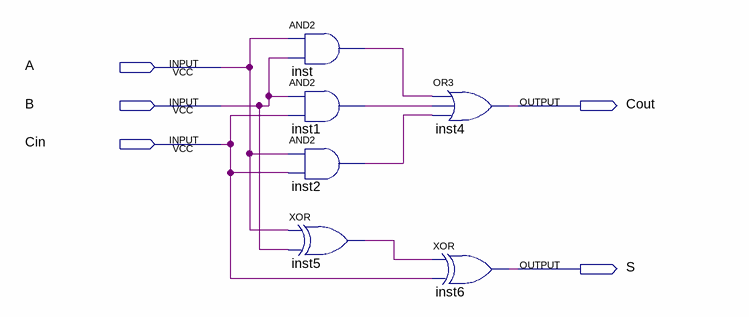
[diagram p0: schematic sheet]
// Quartus schematic TP1.bdf as structural Verilog: 6 symbols, 5 pins
module TP1 (
  input  A,
  input  B,
  input  Cin,
  output Cout,
  output S
);

  wire inst1_out, inst2_out, inst5_out, inst_out;

  and inst (inst_out, A, B);
  and inst1 (inst1_out, B, Cin);
  and inst2 (inst2_out, A, Cin);
  xor inst5 (inst5_out, A, B);
  or inst4 (Cout, inst_out, inst1_out, inst2_out);
  xor inst6 (S, inst5_out, Cin);
endmodule
